# EAGLE design cadet_c1_crystal_adapter_v1.1 (EAGLE 9.6.2)
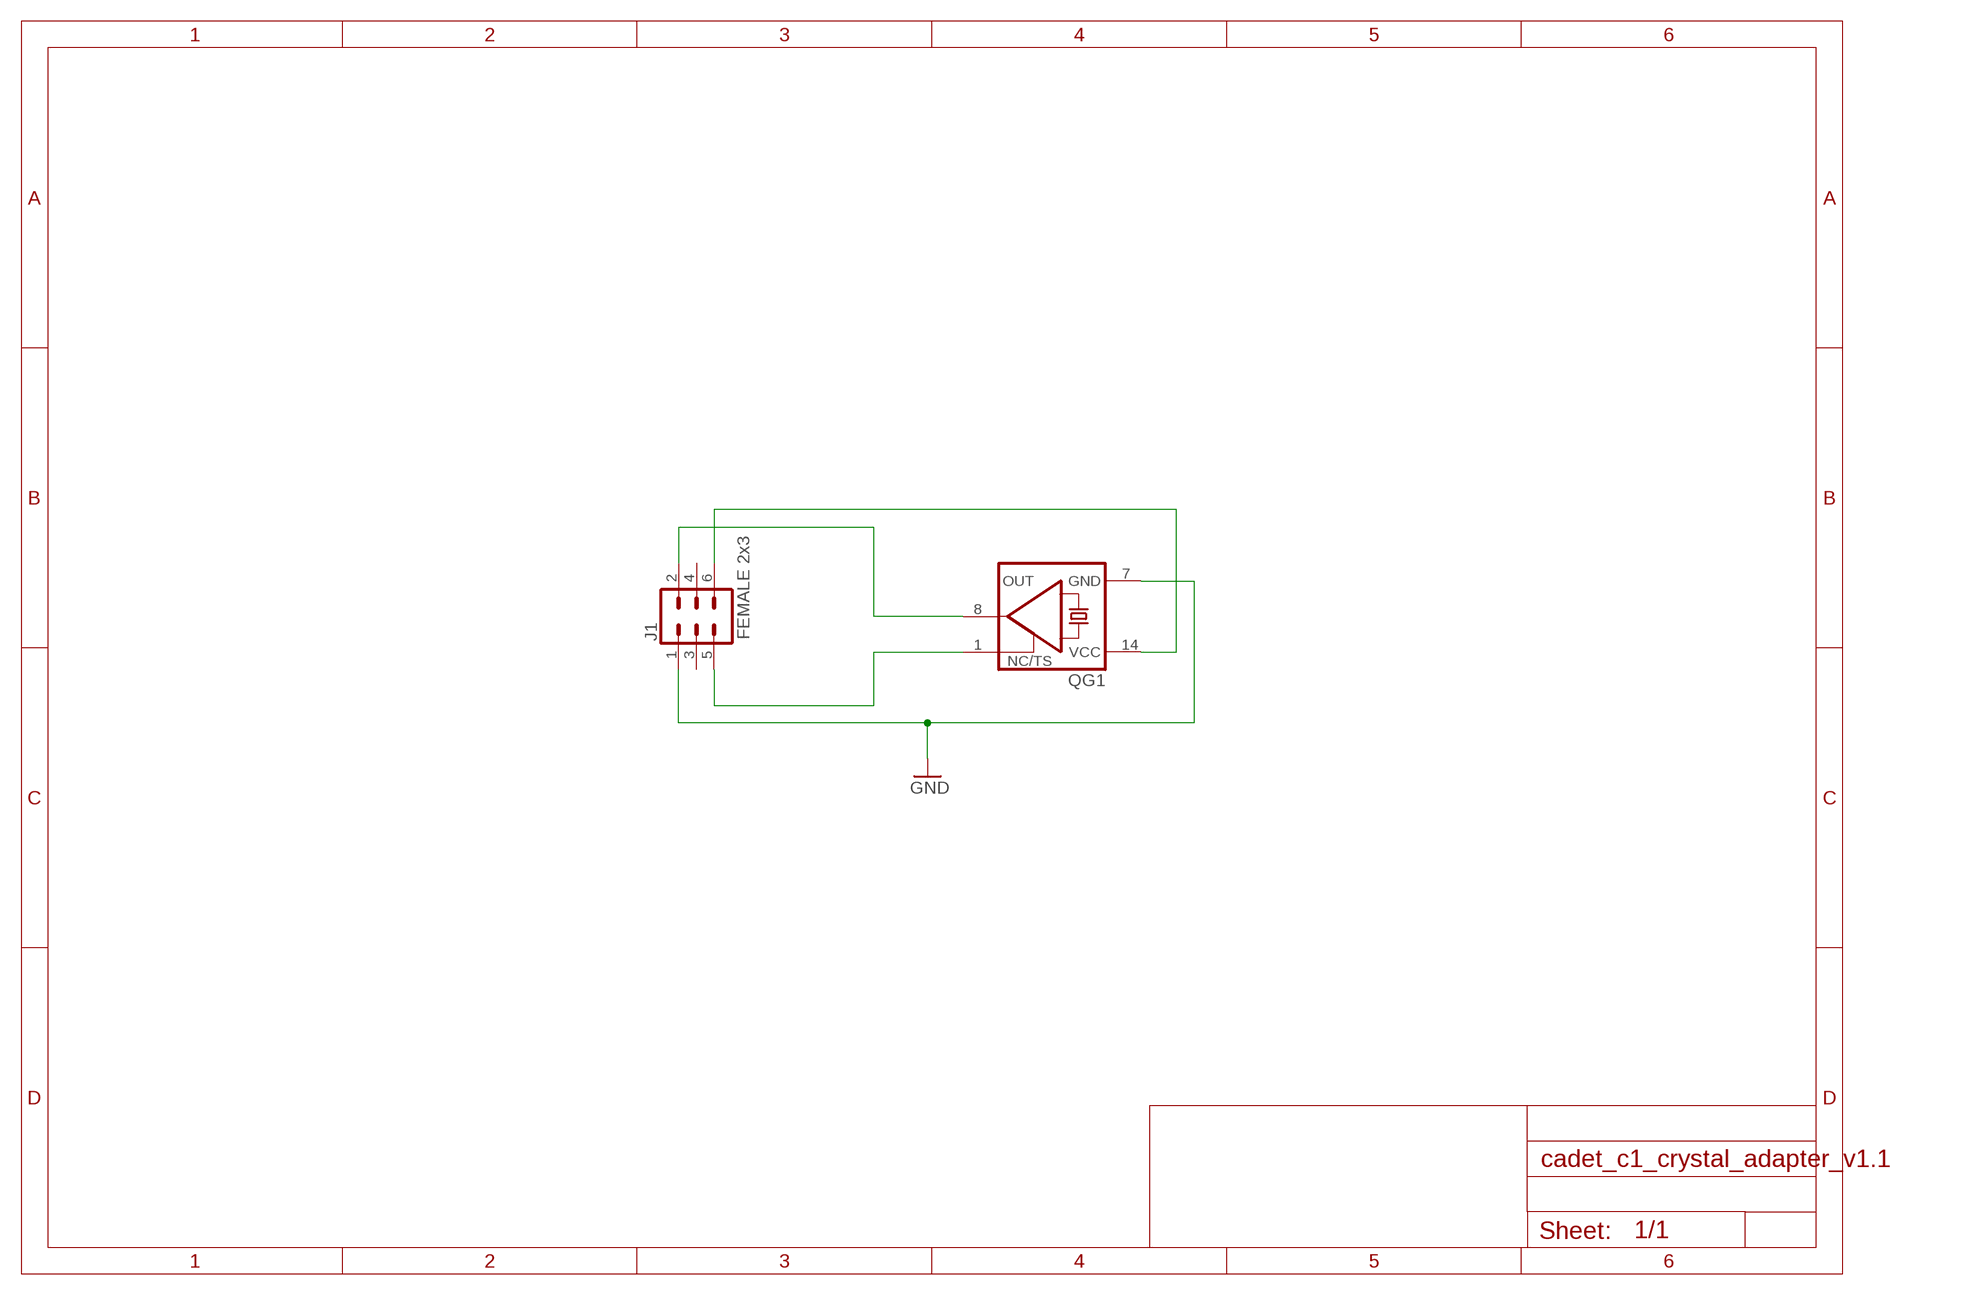
[diagram p0: schematic, sheet 1]

## Parts
J1  FEMALE 2x3  CONN_03X2FEMALE  [2X3]
QG1  XO-14  [DIL14S]

## Nets
GND: J1.1 QG1.7(GND)
N$1: J1.5 QG1.1(TS)
N$3: J1.2 QG1.8(OUT)
N$4: J1.6 QG1.14(VCC)
Unconnected: J1.3 J1.4

## Library data of the parts
J1 = SparkFun-Connectors:CONN_03X2: Multi connection point. Often used as Generic Header-pin footprint for 0.1 inch spaced/style header connections You can populate with any combo of single row headers, but if you'd like an exact match, check these: Header - 2x3 (Male, 0.1") <https://www.sparkfun.com/products/12807> (PRT-12807) Header - 2x3 (Female, 0.1") <https://www.sparkfun.com/products/13010> (PRT-13010) 2x3 Pin Shrouded Header <https://www.sparkfun.com/products/10877> (PRT-10877) On any of the 0.1 inch spaced packages, you can populate with these: Break Away Headers - Straight <https://www.sparkfun.com/products/116> (PRT-00116) Break Away Male Headers - Right Angle <https://www.sparkfun.com/products/553> (PRT-00553) Female Headers <https://www.sparkfun.com/products/115> (PRT-00115) Break Away Headers - Machine Pin <https://www.sparkfun.com/products/117> (PRT-00117) Break Away Female Headers - Swiss Machine Pin <https://www.sparkfun.com/products/743> (PRT-00743) Special note: the shrouded connector mates well with our 3x2 ribbon cables: Ribbon Crimp Connector - 6-pin (2x3, Female) <https://www.sparkfun.com/products/10651> (PRT-10651) Ribbon Cable - 6 wire (15ft) <https://www.sparkfun.com/products/10646> (PRT-10646); PROD_ID: CONN-11566
QG1 = crystal:XO-: CRYSTAL; OC_FARNELL: unknown; OC_NEWARK: unknown

## Board
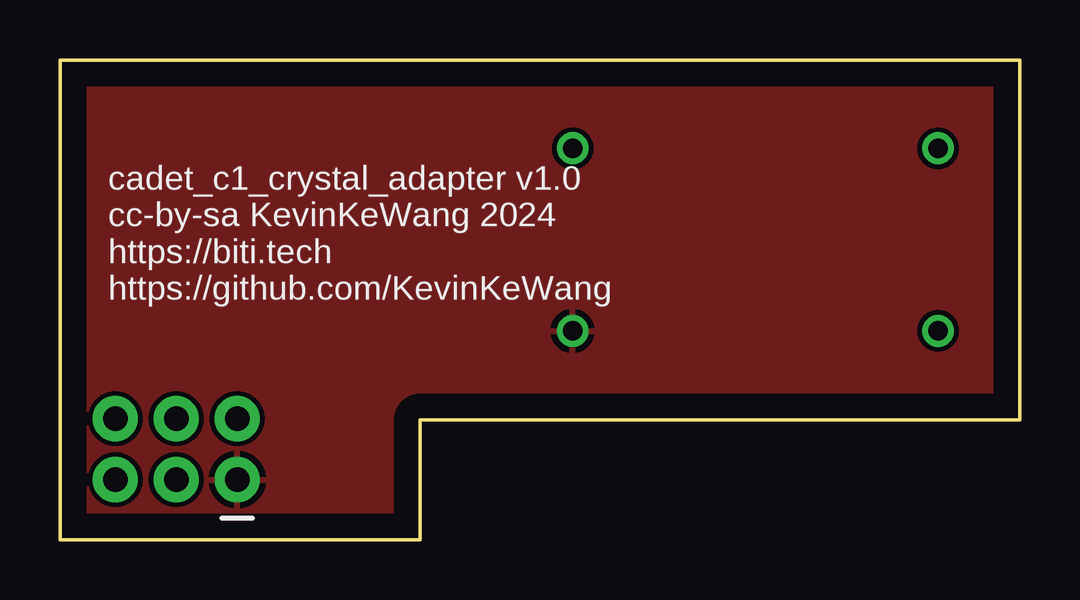
[diagram p1: board, top side]
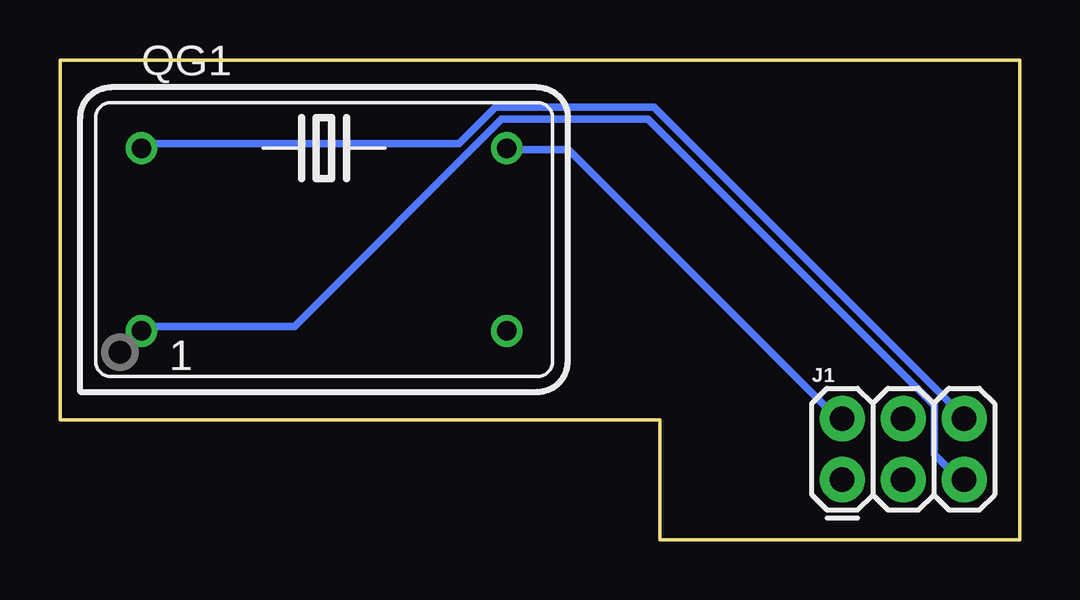
[diagram p2: board, bottom side, seen from below]

Size 40 x 20 mm. Coordinates in mm from the lower left corner, seen from the top.
Outline: 40,20 0,20 0,0 15,0 15,5 40,5 40,20
Copper layers (1*16): Top 0.035mm / dielectric 1.5mm / Bottom 0.035mm
Design rules "default *": minimum track width 12mil, minimum drill 0.35mm, track to track 8mil, track to pad 6mil, pad to pad 6mil, via to via 6mil, smd to smd 6mil, copper to edge 40mil, drill to drill 6mil, minimum pad ring 10mil, minimum via ring 8mil, stop-mask expansion 4mil, vias tented up to drill 0mil, thermal gap 10mil

### Footprints (pad centres in the part's own frame; a part is rotated, then mirrored left to right if it is on the bottom)
2X3 = drill 1.016 pad 1.88: 1 0,0; 2 0,2.54; 3 2.54,0; 4 2.54,2.54; 5 5.08,0; 6 5.08,2.54
DIL14S = drill 0.813: 1 -7.62,-3.81; 7 7.62,-3.81; 8 7.62,3.81; 14 -7.62,3.81

### Placement (x,y rotation side)
J1  7.39,2.5 0 bottom
QG1  28.99,12.51 0 bottom

### Tracks (layer width: path | path; a pad name or v marks a point on that pad's centre or on a via)
GND
  pour Top: 0,20 0,0 15,0 15,5 40,5 40,20
N$1
  Bottom 0.305: QG1.1 36.58,8.89 30.23,8.89 21.59,17.53 15.49,17.53 3.56,5.59 3.56,3.56 2.54,2.54 J1.5
N$3
  Bottom 0.305: QG1.8 21.34,16.26 18.8,16.26 7.62,5.08 J1.2
N$4
  Bottom 0.305: QG1.14 36.58,16.51 23.37,16.51 21.84,18.03 15.24,18.03 2.29,5.08 J1.6

### Text on the board
tNames: cadet_c1_crystal_adapter v1.0 / cc-by-sa KevinKeWang 2024 / https://biti.tech / https://github.com/KevinKeWang